# EAGLE design rpi2_ctrl (EAGLE 7.6.0)
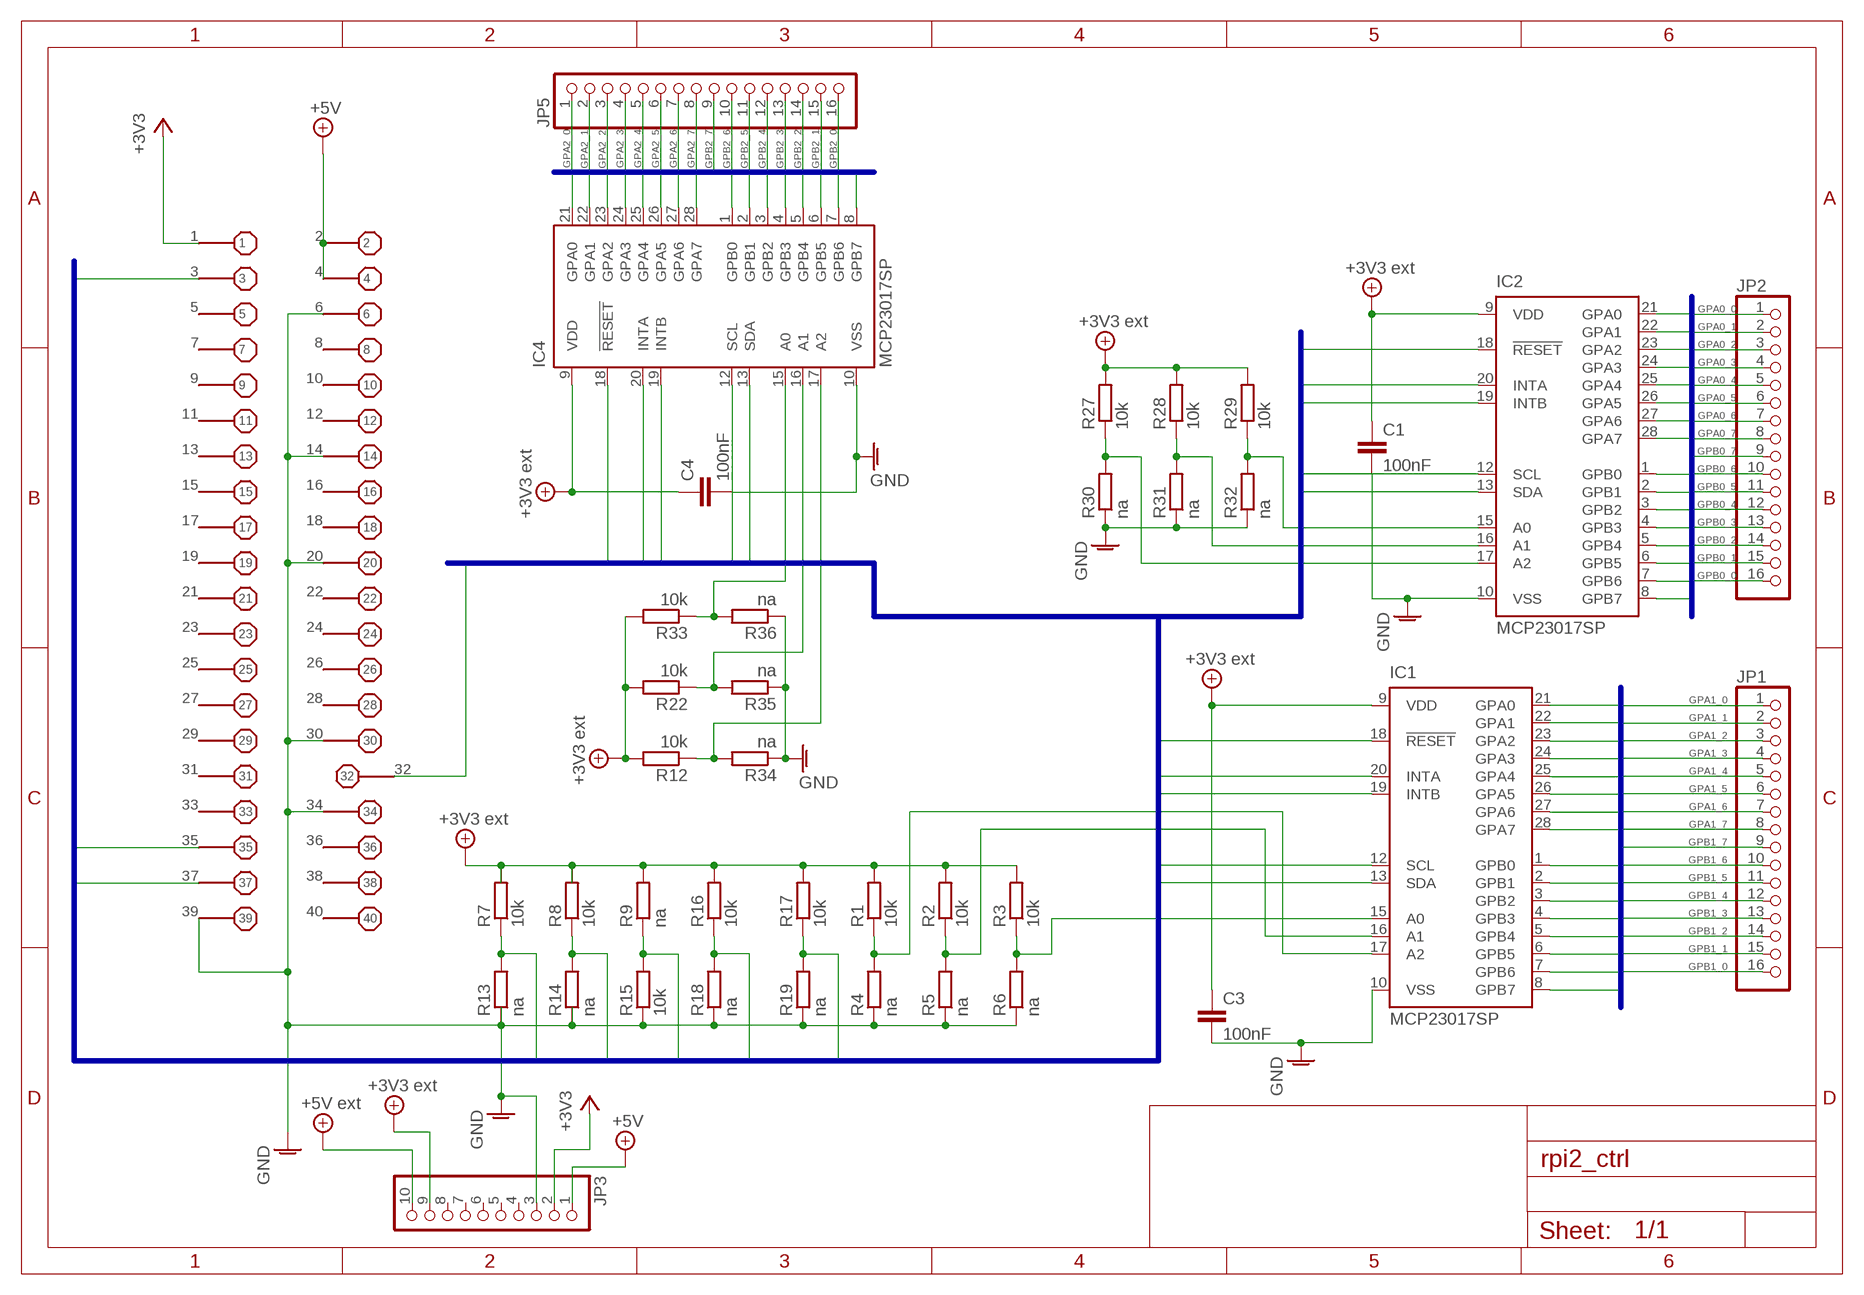
[diagram p0: schematic, sheet 1]

## Parts
C1  100nF  C-EUC0603  [C0603]
C3  100nF  C-EUC0603  [C0603]
C4  100nF  C-EUC0603  [C0603]
IC1  MCP23017SP  [DIL28-3]
IC2  MCP23017SP  [DIL28-3]
IC4  MCP23017SP  [DIL28-3]
JP1  PINHD-1X16  [1X16]
JP2  PINHD-1X16  [1X16]
JP3  PINHD-1X10  [1X10]
JP5  PINHD-1X16  [1X16]
R1  10k  R-EU_R0603  [R0603]
R2  10k  R-EU_R0603  [R0603]
R3  10k  R-EU_R0603  [R0603]
R4  na  R-EU_R0603  [R0603]
R5  na  R-EU_R0603  [R0603]
R6  na  R-EU_R0603  [R0603]
R7  10k  R-EU_R0603  [R0603]
R8  10k  R-EU_R0603  [R0603]
R9  na  R-EU_R0603  [R0603]
R12  10k  R-EU_R0603  [R0603]
R13  na  R-EU_R0603  [R0603]
R14  na  R-EU_R0603  [R0603]
R15  10k  R-EU_R0603  [R0603]
R16  10k  R-EU_R0603  [R0603]
R17  10k  R-EU_R0603  [R0603]
R18  na  R-EU_R0603  [R0603]
R19  na  R-EU_R0603  [R0603]
R22  10k  R-EU_R0603  [R0603]
R27  10k  R-EU_R0603  [R0603]
R28  10k  R-EU_R0603  [R0603]
R29  10k  R-EU_R0603  [R0603]
R30  na  R-EU_R0603  [R0603]
R31  na  R-EU_R0603  [R0603]
R32  na  R-EU_R0603  [R0603]
R33  10k  R-EU_R0603  [R0603]
R34  na  R-EU_R0603  [R0603]
R35  na  R-EU_R0603  [R0603]
R36  na  R-EU_R0603  [R0603]
X1  B+_GPIO  [B+_GPIO]

## Nets
3V3EXT: C3.1 IC1.9(VDD) JP3.9 R1.2 R2.2 R3.2 R7.2 R8.2 R9.2 R12.2 R16.2 R17.2 R22.2 R27.2 R28.2 R29.2 R33.2 ; supply symbol labelled +3V3 ext
+3V3: JP3.2 X1.1
+5V: JP3.1 X1.2 X1.4
+5V/1: JP3.10 ; supply symbol labelled +5V ext
+5V/2: C1.1 C4.1 IC2.9(VDD) IC4.9(VDD) ; supply symbol labelled +3V3 ext
GND: C1.2 C3.2 C4.2 IC1.10(VSS) IC2.10(VSS) IC4.10(VSS) JP3.3 R4.1 R5.1 R6.1 R13.1 R14.1 R15.1 R18.1 R19.1 R30.1 R31.1 R32.1 R34.1 R35.1 R36.1 X1.6 X1.14 X1.20 X1.30 X1.34 X1.39
GPA0_0: IC2.21(GPA0) JP2.1
GPA0_1: IC2.22(GPA1) JP2.2
GPA0_2: IC2.23(GPA2) JP2.3
GPA0_3: IC2.24(GPA3) JP2.4
GPA0_4: IC2.25(GPA4) JP2.5
GPA0_5: IC2.26(GPA5) JP2.6
GPA0_6: IC2.27(GPA6) JP2.7
GPA0_7: IC2.28(GPA7) JP2.8
GPA1_0: IC1.21(GPA0) JP1.1
GPA1_1: IC1.22(GPA1) JP1.2
GPA1_2: IC1.23(GPA2) JP1.3
GPA1_3: IC1.24(GPA3) JP1.4
GPA1_4: IC1.25(GPA4) JP1.5
GPA1_5: IC1.26(GPA5) JP1.6
GPA1_6: IC1.27(GPA6) JP1.7
GPA1_7: IC1.28(GPA7) JP1.8
GPA2_0: IC4.21(GPA0) JP5.1
GPA2_1: IC4.22(GPA1) JP5.2
GPA2_2: IC4.23(GPA2) JP5.3
GPA2_3: IC4.24(GPA3) JP5.4
GPA2_4: IC4.25(GPA4) JP5.5
GPA2_5: IC4.26(GPA5) JP5.6
GPA2_6: IC4.27(GPA6) JP5.7
GPA2_7: IC4.28(GPA7) JP5.8
GPB0_0: IC2.1(GPB0) JP2.16
GPB0_1: IC2.2(GPB1) JP2.15
GPB0_2: IC2.3(GPB2) JP2.14
GPB0_3: IC2.4(GPB3) JP2.13
GPB0_4: IC2.5(GPB4) JP2.12
GPB0_5: IC2.6(GPB5) JP2.11
GPB0_6: IC2.7(GPB6) JP2.10
GPB0_7: IC2.8(GPB7) JP2.9
GPB1_0: IC1.1(GPB0) JP1.16
GPB1_1: IC1.2(GPB1) JP1.15
GPB1_2: IC1.3(GPB2) JP1.14
GPB1_3: IC1.4(GPB3) JP1.13
GPB1_4: IC1.5(GPB4) JP1.12
GPB1_5: IC1.6(GPB5) JP1.11
GPB1_6: IC1.7(GPB6) JP1.10
GPB1_7: IC1.8(GPB7) JP1.9
GPB2_0: IC4.1(GPB0) JP5.16
GPB2_1: IC4.2(GPB1) JP5.15
GPB2_2: IC4.3(GPB2) JP5.14
GPB2_3: IC4.4(GPB3) JP5.13
GPB2_4: IC4.5(GPB4) JP5.12
GPB2_5: IC4.6(GPB5) JP5.11
GPB2_6: IC4.7(GPB6) JP5.10
GPB2_7: IC4.8(GPB7) JP5.9
INTA: IC1.20(INTA) IC2.20(INTA) IC4.20(INTA) R17.1 R19.2 X1.37
INTB: IC1.19(INTB) IC2.19(INTB) IC4.19(INTB) R16.1 R18.2 X1.35
N$1: IC1.17(A2) R1.1 R4.2
N$2: IC1.16(A1) R2.1 R5.2
N$5: IC2.17(A2) R27.1 R30.2
N$7: IC2.16(A1) R28.1 R31.2
N$8: IC1.15(A0) R3.1 R6.2
N$9: IC2.15(A0) R29.1 R32.2
N$20: IC4.17(A2) R12.1 R34.2
N$21: IC4.16(A1) R22.1 R35.2
N$22: IC4.15(A0) R33.1 R36.2
NRES: IC1.18(!RESET) IC2.18(!RESET) IC4.18(!RESET) R9.1 R15.2 X1.32
SCL: IC1.12(SCL) IC2.12(SCL) IC4.12(SCL) R8.1 R14.2
SDA: IC1.13(SDA) IC2.13(SDA) IC4.13(SDA) R7.1 R13.2 X1.3
Unconnected: JP3.4 JP3.5 JP3.6 JP3.7 JP3.8 X1.5 X1.7 X1.8 X1.9 X1.10 X1.11 X1.12 X1.13 X1.15 X1.16 X1.17 X1.18 X1.19 X1.21 X1.22 X1.23 X1.24 X1.25 X1.26 X1.27 X1.28 X1.29 X1.31 X1.33 X1.36 X1.38 X1.40

## Buses
GPA2_[0..7],GPB2_[0..7]
INTA,INTB,SCL,SDA,NRES
GPA0_[0..7],GPB0_[0..7]
GPA1_[0..7],GPB1_[0..7]

## Library data of the parts
C1 C3 C4 = rcl:C-EU: CAPACITOR, European symbol
IC1 IC2 IC4 = microchip:MCP23017: http://ww1.microchip.com/downloads/en/DeviceDoc/21952a.pdf Source: http://ww1.microchip.com/downloads/en/DeviceDoc/21952a.pdf; MF: MICROCHIP; MPN: MCP23017-E/SP; OC_FARNELL: 1332088; OC_NEWARK: 31K2959
JP1 JP2 JP5 = pinhead:PINHD-1X16: PIN HEADER
JP3 = pinhead:PINHD-1X10: PIN HEADER
R1-R9 R12-R19 R22 R27-R36 = rcl:R-EU_: RESISTOR, European symbol
X1 = raspberry:B+_GPIO

## Board
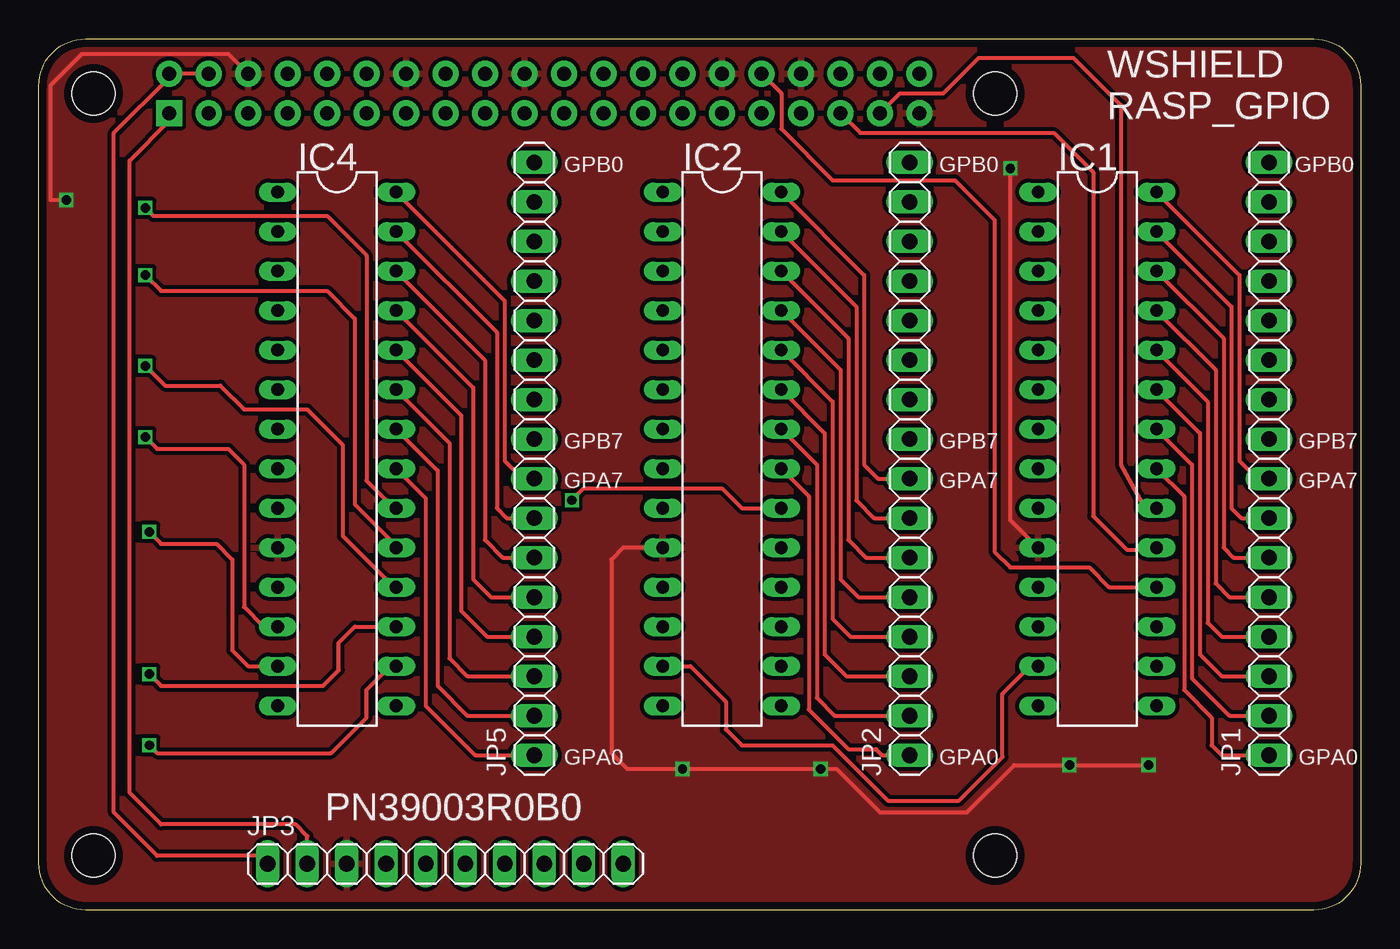
[diagram p1: board, top side]
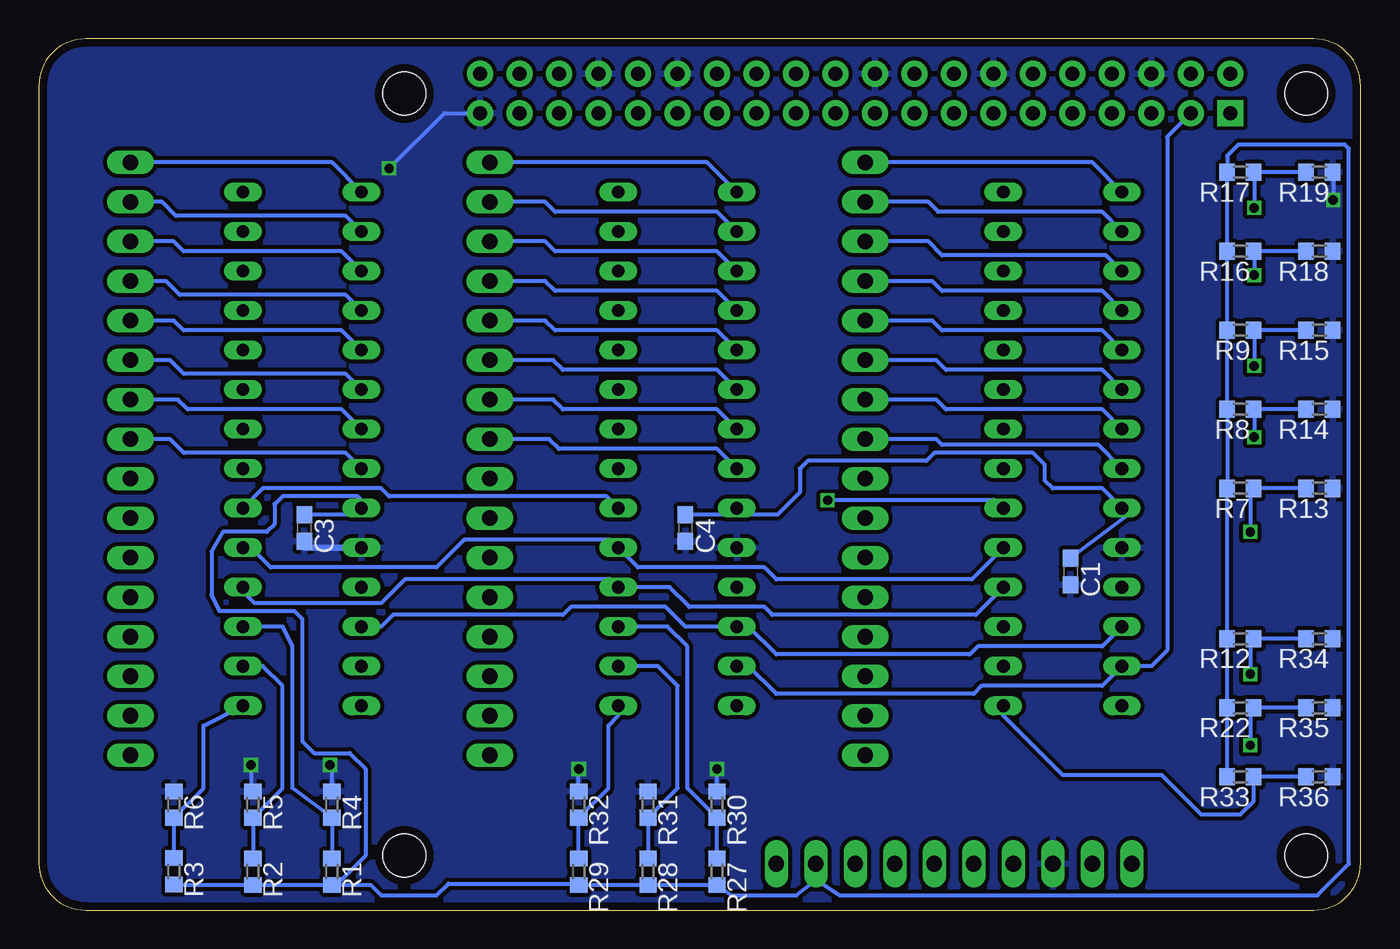
[diagram p2: board, bottom side, seen from below]

Size 85 x 56 mm. Coordinates in mm from the lower left corner, seen from the top.
Outline: 0,53 arc-90 3,56 82,56 arc-90 85,53 85,3 arc-90 82,0 3,0 arc-90 0,3 0,53
Copper layers (1*16): Top 0.035mm / dielectric 1.6mm / Bottom 0.035mm
Design rules "Elecrow_2-layer_PCB_eagle_rule": minimum track width 6mil, minimum drill 12mil, track to track 6mil, track to pad 6mil, pad to pad 6mil, via to via 8mil, smd to smd 0mil, copper to edge 20mil, drill to drill 10mil, minimum pad ring 6mil, minimum via ring 6mil, stop-mask expansion 0mil, vias tented up to drill 100mil, thermal gap 10mil
Holes 2.75 mm at 3.5,52.5 3.5,3.5 61.5,52.5 61.5,3.5

### Footprints (pad centres in the part's own frame; a part is rotated, then mirrored left to right if it is on the bottom)
C0603 = smd 1.1 x 1: 1 -0.85,0; 2 0.85,0
DIL28-3 = drill 0.813 long: 1 -16.51,-3.81; 2 -13.97,-3.81; 3 -11.43,-3.81; 4 -8.89,-3.81; 5 -6.35,-3.81; 6 -3.81,-3.81; 7 -1.27,-3.81; 8 1.27,-3.81; 9 3.81,-3.81; 10 6.35,-3.81; 11 8.89,-3.81; 12 11.43,-3.81; 13 13.97,-3.81; 14 16.51,-3.81; 15 16.51,3.81; 16 13.97,3.81; 17 11.43,3.81; 18 8.89,3.81; 19 6.35,3.81; 20 3.81,3.81; 21 1.27,3.81; 22 -1.27,3.81; 23 -3.81,3.81; 24 -6.35,3.81; 25 -8.89,3.81; 26 -11.43,3.81; 27 -13.97,3.81; 28 -16.51,3.81
1X16 = drill 1.016 long: 1 -19.05,0; 2 -16.51,0; 3 -13.97,0; 4 -11.43,0; 5 -8.89,0; 6 -6.35,0; 7 -3.81,0; 8 -1.27,0; 9 1.27,0; 10 3.81,0; 11 6.35,0; 12 8.89,0; 13 11.43,0; 14 13.97,0; 15 16.51,0; 16 19.05,0
1X10 = drill 1.016 long: 1 -11.43,0; 2 -8.89,0; 3 -6.35,0; 4 -3.81,0; 5 -1.27,0; 6 1.27,0; 7 3.81,0; 8 6.35,0; 9 8.89,0; 10 11.43,0
R0603 = smd 1 x 1.1: 1 -0.85,0; 2 0.85,0
B+_GPIO = drill 0.9 pad 1.676 square: 1 -24.13,-1.27 | drill 0.9 pad 1.676: 2 -24.13,1.27; 3 -21.59,-1.27; 4 -21.59,1.27; 5 -19.05,-1.27; 6 -19.05,1.27; 7 -16.51,-1.27; 8 -16.51,1.27; 9 -13.97,-1.27; 10 -13.97,1.27; 11 -11.43,-1.27; 12 -11.43,1.27; 13 -8.89,-1.27; 14 -8.89,1.27; 15 -6.35,-1.27; 16 -6.35,1.27; 17 -3.81,-1.27; 18 -3.81,1.27; 19 -1.27,-1.27; 20 -1.27,1.27; 21 1.27,-1.27; 22 1.27,1.27; 23 3.81,-1.27; 24 3.81,1.27; 25 6.35,-1.27; 26 6.35,1.27; 27 8.89,-1.27; 28 8.89,1.27; 29 11.43,-1.27; 30 11.43,1.27; 31 13.97,-1.27; 32 13.97,1.27; 33 16.51,-1.27; 34 16.51,1.27; 35 19.05,-1.27; 36 19.05,1.27; 37 21.59,-1.27; 38 21.59,1.27; 39 24.13,-1.27; 40 24.13,1.27

### Placement (x,y rotation side)
C1  18.66,21.77 270 bottom
C3  67.93,24.56 270 bottom
C4  43.42,24.56 270 bottom
IC1  68.06,29.64 270 top
IC2  43.93,29.64 270 top
IC4  19.16,29.64 270 top
JP1  79.11,29 90 top
JP2  55.99,29 90 top
JP3  26.15,2.97 0 top
JP5  31.87,29 90 top
R1  66.15,2.46 270 bottom
R2  71.23,2.46 270 bottom
R3  76.31,2.49 270 bottom
R4  66.15,6.78 270 bottom
R5  71.23,6.78 270 bottom
R6  76.31,6.78 270 bottom
R7  7.74,27.1 180 bottom
R8  7.74,32.18 180 bottom
R9  7.74,37.26 180 bottom
R12  7.74,17.45 180 bottom
R13  2.66,27.1 180 bottom
R14  2.66,32.18 180 bottom
R15  2.66,37.26 180 bottom
R16  7.74,42.34 180 bottom
R17  7.74,47.42 180 bottom
R18  2.66,42.34 180 bottom
R19  2.66,47.42 180 bottom
R22  7.74,13 180 bottom
R27  41.39,2.46 270 bottom
R28  45.84,2.46 270 bottom
R29  50.28,2.46 270 bottom
R30  41.39,6.78 270 bottom
R31  45.84,6.78 270 bottom
R32  50.28,6.78 270 bottom
R33  7.74,8.56 180 bottom
R34  2.66,17.45 180 bottom
R35  2.66,13 180 bottom
R36  2.66,8.56 180 bottom
X1  32.5,52.5 0 top

### Tracks (layer width: path | path; a pad name or v marks a point on that pad's centre or on a via)
3V3EXT
  Bottom 0.254: R3.2 71.23,1.64 R2.2 R1.2 | IC1.9 65.1,25.41 | 65.1,25.41 C3.1 | 35.04,1.95 36.31,0.94 40.46,0.94 R27.2 R28.2 R29.2 50.37,1.7 58.66,1.7 59.42,0.94 62.98,0.94 63.65,1.61 R1.2 | JP3.9 35.04,1.95 | 35.04,1.95 33.52,0.94 2.78,0.94 0.75,2.97 0.75,48.94 1,49.2 7.86,49.2 8.59,48.48 R17.2 R16.2 R9.2 R8.2 R7.2 R12.2 R22.2 R33.2 | 65.1,25.41 64.25,26.26 64.25,26.34 64.5,26.59 69.33,26.59 69.84,26.08 69.84,24.81 70.35,24.31 73.14,24.31 73.9,23.04 73.9,20.24 73.39,19.23 68.57,19.23 68.06,18.72 68.06,10.84 67.3,10.08 65.01,10.08 64,9.07 64,3.48 65.86,1.61 R1.2
+3V3
  Top 0.254: JP3.2 17.26,4.75 16.5,5.51 7.86,5.51 5.83,7.54 5.83,48.18 8.37,50.72 X1.1
+5V
  Top 0.254: X1.4 X1.2 8.37,53.52 4.81,49.96 4.81,6.27 7.61,3.48 14.21,3.48 JP3.1
+5V/2
  Bottom 0.254: IC2.9 39.7,25.41 C4.1 37.49,25.41 36.06,26.85 36.06,28.37 35.55,28.88 27.93,28.88 27.42,29.39 21.07,29.39 20.31,28.62 20.31,27.61 19.8,27.1 16.62,27.1 IC4.9 14.94,25.41 C1.1
GND  (via drill 0.6)
  Top 0.254: v1.77,45.64 0.75,45.64 0.75,53.01 2.78,55.04 12.18,55.04 X1.6 | IC2.10 37.58,23.29 36.82,22.53 36.82,10.08 37.83,9.07 v41.39,9.07 v50.28,9.07 51.3,9.07 54.09,6.27 59.68,6.27 62.73,9.32 v66.28,9.32 v71.36,9.32 | IC1.10 62.47,25.07 v62.47,47.67
  Bottom 0.254: R19.1 1.77,47.42 v1.77,45.64 | v71.36,9.32 71.36,7.76 R5.1 | R4.1 66.15,9.19 v66.28,9.32 | R32.1 v50.28,9.07 | R30.1 v41.39,9.07 | v62.47,47.67 58.92,51.23 X1.39
  Bottom 0.406: IC1.10 67.93,23.29 C3.2
  pour Bottom (isolate 0.254): -0.52,52.5 arc-90 3.29,56.31 7.1,56.31 82.03,56.31 arc-90 84.57,53.77 84.57,2.97 arc-90 82.03,0.43 3.29,0.43 arc-90 -0.52,4.24
  pour Top (isolate 0.254): -0.52,52.5 arc-90 3.29,56.31 82.03,56.31 arc-90 84.57,53.77 84.57,2.97 arc-90 82.03,0.43 78.22,0.43 3.29,0.43 arc-90 -0.52,4.24
GPA0_0
  Top 0.254: IC2.21 49.52,26.59 49.52,12.88 52.06,10.34 53.84,10.34 54.22,9.96 JP2.1
GPA0_1
  Top 0.254: IC2.22 50.03,28.62 50.03,13.64 51.17,12.5 JP2.2
GPA0_2
  Top 0.254: IC2.23 50.53,30.66 50.53,16.43 51.93,15.04 JP2.3
GPA0_3
  Top 0.254: IC2.24 51.04,32.69 51.04,18.72 52.19,17.57 JP2.4
GPA0_4
  Top 0.254: IC2.25 51.55,34.72 51.55,21.26 52.69,20.12 JP2.5
GPA0_5
  Top 0.254: IC2.26 52.06,36.75 52.06,23.8 53.2,22.66 JP2.6
GPA0_6
  Top 0.254: IC2.27 52.57,38.78 52.57,26.34 53.71,25.2 JP2.7
GPA0_7
  Top 0.254: IC2.28 53.07,40.82 53.07,28.62 53.96,27.73 JP2.8
GPA1_0
  Top 0.254: IC1.21 73.65,26.59 73.65,14.15 75.43,12.37 75.43,10.59 76.06,9.96 JP1.1
GPA1_1
  Top 0.254: IC1.22 74.16,28.62 74.16,14.91 76.57,12.5 JP1.2
GPA1_2
  Top 0.254: IC1.23 74.66,30.66 74.66,16.43 76.06,15.04 JP1.3
GPA1_3
  Top 0.254: IC1.24 75.17,32.69 75.17,18.46 76.06,17.57 JP1.4
GPA1_4
  Top 0.254: IC1.25 75.68,34.72 75.68,21 76.57,20.12 JP1.5
GPA1_5
  Top 0.254: IC1.26 76.19,36.75 76.19,23.29 76.82,22.66 JP1.6
GPA1_6
  Top 0.254: IC1.27 76.7,38.78 76.7,25.83 77.33,25.2 JP1.7
GPA1_7
  Top 0.254: IC1.28 77.2,40.82 77.2,28.88 78.35,27.73 JP1.8
GPA2_0
  Top 0.254: IC4.21 24.88,26.46 24.88,13.13 28.05,9.96 JP5.1
GPA2_1
  Top 0.254: IC4.22 25.64,28.24 25.64,14.4 27.55,12.5 JP5.2
GPA2_2
  Top 0.254: IC4.23 26.4,30.02 26.4,16.18 27.55,15.04 JP5.3
GPA2_3
  Top 0.254: IC4.24 27.17,31.8 27.17,19.23 28.82,17.57 JP5.4
GPA2_4
  Top 0.254: IC4.25 27.93,33.58 27.93,21.26 29.07,20.12 JP5.5
GPA2_5
  Top 0.254: IC4.26 28.69,35.36 28.69,23.8 29.83,22.66 JP5.6
GPA2_6
  Top 0.254: IC4.27 29.45,37.13 29.45,25.83 30.09,25.2 JP5.7
GPA2_7
  Top 0.254: IC4.28 29.96,39.16 29.96,28.88 31.1,27.73 JP5.8
GPB0_0
  Bottom 0.254: IC2.1 42.02,48.05 JP2.16
GPB0_1
  Bottom 0.254: IC2.2 41.39,44.88 51.8,44.88 52.44,45.52 JP2.15
GPB0_2
  Bottom 0.254: IC2.3 41.39,42.34 51.8,42.34 52.44,42.98 JP2.14
GPB0_3
  Bottom 0.254: IC2.4 41.39,39.8 51.8,39.8 52.44,40.44 JP2.13
GPB0_4
  Bottom 0.254: IC2.5 41.39,37.26 51.8,37.26 52.44,37.9 JP2.12
GPB0_5
  Bottom 0.254: IC2.6 41.39,34.72 51.3,34.72 51.93,35.36 JP2.11
GPB0_6
  Bottom 0.254: IC2.7 41.39,32.18 51.3,32.18 51.93,32.81 JP2.10
GPB0_7
  Bottom 0.254: IC2.8 41.39,29.64 51.55,29.64 52.19,30.27 JP2.9
GPB1_0
  Bottom 0.254: IC1.1 66.15,48.05 JP1.16
GPB1_1
  Bottom 0.254: IC1.2 65.27,44.63 76.19,44.63 77.08,45.52 JP1.15
GPB1_2
  Bottom 0.254: IC1.3 65.52,42.34 75.68,42.34 76.31,42.98 JP1.14
GPB1_3
  Bottom 0.254: IC1.4 65.27,39.55 75.93,39.55 76.82,40.44 JP1.13
GPB1_4
  Bottom 0.254: IC1.5 65.52,37.26 75.68,37.26 76.31,37.9 JP1.12
GPB1_5
  Bottom 0.254: IC1.6 65.27,34.47 75.68,34.47 76.57,35.36 JP1.11
GPB1_6
  Bottom 0.254: IC1.7 65.52,32.18 75.43,32.18 76.06,32.81 JP1.10
GPB1_7
  Bottom 0.254: IC1.8 65.27,29.39 75.68,29.39 76.57,30.27 JP1.9
GPB2_0
  Bottom 0.254: IC4.1 17.26,48.05 JP5.16
GPB2_1
  Bottom 0.254: IC4.2 16.62,44.88 27.17,44.88 27.8,45.52 JP5.15
GPB2_2
  Bottom 0.254: IC4.3 16.37,42.09 26.91,42.09 27.8,42.98 JP5.14
GPB2_3
  Bottom 0.254: IC4.4 16.62,39.8 26.91,39.8 27.55,40.44 JP5.13
GPB2_4
  Bottom 0.254: IC4.5 16.62,37.26 26.91,37.26 27.55,37.9 JP5.12
GPB2_5
  Bottom 0.254: IC4.6 16.62,34.72 26.66,34.72 27.29,35.36 JP5.11
GPB2_6
  Bottom 0.254: IC4.7 16.62,32.18 26.66,32.18 27.29,32.81 JP5.10
GPB2_7
  Bottom 0.254: IC4.8 16.88,29.89 26.91,29.89 27.29,30.27 JP5.9
INTA  (via drill 0.6)
  Top 0.254: v34.28,26.34 35.04,27.1 43.93,27.1 45.2,25.83 IC2.20 | IC1.20 71.11,25.83 69.58,28.62 69.58,51.74 66.54,54.79 60.44,54.79 58.15,52.5 55.36,52.5 X1.37 | v6.85,45.13 7.35,44.63 18.53,44.63 21.07,42.09 21.07,27.61 22.85,25.83 IC4.20
  Bottom 0.254: R19.2 R17.1 6.85,47.38 v6.85,45.13 | IC4.20 23.48,26.34 v34.28,26.34 | IC2.20 48.5,26.59 62.47,26.59 62.98,27.1 70.6,27.1 IC1.20
INTB  (via drill 0.6)
  Top 0.254: X1.35 52.82,49.96 65.27,49.96 67.81,47.42 67.81,25.32 69.96,23.16 71.23,23.16 71.36,23.29 IC1.19 | v6.85,40.82 7.86,39.8 18.53,39.8 20.31,38.02 20.31,26.08 22.98,23.42 IC4.19
  Bottom 0.254: R18.2 R16.1 6.85,42.3 v6.85,40.82 | IC1.19 71.36,23.29 70.09,22.02 59.42,22.02 57.65,23.8 48.25,23.8 IC2.19 46.47,22.02 38.34,22.02 37.58,21.26 25.01,21.26 IC4.19
N$1
  Bottom 0.254: R1.1 R4.2 68.69,7.84 68.69,16.94 69.33,18.21 IC1.17
N$2
  Bottom 0.254: R2.1 R5.2 69.33,7.84 69.33,14.4 70.6,15.67 IC1.16
N$5
  Bottom 0.254: R27.1 R30.2 43.3,7.84 43.3,16.94 44.56,18.21 IC2.17
N$7
  Bottom 0.254: R28.1 R31.2 43.93,7.84 43.93,14.4 45.2,15.67 IC2.16
N$8
  Bottom 0.254: R3.1 R6.2 74.41,7.84 74.41,11.86 IC1.15
N$9
  Bottom 0.254: R29.1 R32.2 48.38,7.84 48.38,11.86 47.74,12.5 IC2.15
N$20  (via drill 0.6)
  Top 0.254: v7.1,15.16 7.86,14.4 18.28,14.4 19.29,15.42 19.29,17.19 20.31,18.21 IC4.17
  Bottom 0.254: R34.2 R12.1 7.1,17.23 v7.1,15.16
N$21  (via drill 0.6)
  Top 0.254: v7.1,10.59 7.61,10.08 18.78,10.08 21.07,12.37 21.07,14.15 22.59,15.67 IC4.16
  Bottom 0.254: R35.2 R22.1 7.1,12.79 v7.1,10.59
N$22
  Bottom 0.254: R36.2 R33.1 6.89,7 7.74,6.15 10.27,6.15 12.82,8.69 19.16,8.69 22.98,12.5 IC4.15
NRES  (via drill 0.6)
  Top 0.254: v6.85,34.97 8.12,33.7 11.67,33.7 13.2,32.18 17.26,32.18 19.55,29.89 19.55,24.05 22.85,20.75 IC4.18 | X1.32 47.74,52.5 47.74,50.21 51.04,46.91 58.92,46.91 61.46,44.37 61.46,23.04 62.47,22.02 67.55,22.02 68.82,20.75 IC1.18
  Bottom 0.254: R15.2 R9.1 6.85,37.22 v6.85,34.97 | IC4.18 24.75,18.97 37.83,18.97 38.34,19.48 43.17,19.48 44.44,20.75 IC2.18 48.25,21.26 61.46,21.26 62.98,19.73 71.11,19.73 72.12,20.75 IC1.18
SCL  (via drill 0.6)
  Top 0.254: v6.85,30.4 7.61,29.64 12.18,29.64 13.2,28.62 13.2,19.48 14.47,18.21 IC4.12
  Bottom 0.254: R14.2 R8.1 6.85,32.14 v6.85,30.4 | IC4.12 16.62,16.94 24.63,16.94 25.13,16.43 37.58,16.43 39.36,18.21 IC2.12 43.42,18.21 44.69,19.48 50.79,19.48 51.3,18.97 62.22,18.97 62.98,18.21 IC1.12
SDA  (via drill 0.6)
  Top 0.254: IC2.13 41.9,15.67 44.18,13.38 44.18,11.61 45.2,10.59 51.04,10.59 54.6,7.03 59.17,7.03 61.96,9.83 61.96,13.89 63.74,15.67 IC1.13 | v7.1,24.31 7.86,23.54 11.42,23.54 12.43,22.53 12.43,16.69 13.45,15.67 IC4.13
  Bottom 0.254: R13.2 R7.1 7.1,26.89 v7.1,24.31 | IC2.13 39.36,15.67 37.58,13.89 24.88,13.89 24.37,14.4 16.62,14.4 IC4.13 13.45,15.67 12.43,16.69 12.43,49.71 X1.3

### Text on the board
tNames: WSHIELD / RASP_GPIO | GPB0 | GPB0 | GPB0 | GPB7 | GPB7 | GPB7 | GPA7 | GPA7 | GPA7 | GPA0 | GPA0 | GPA0 | PN39003R0B0